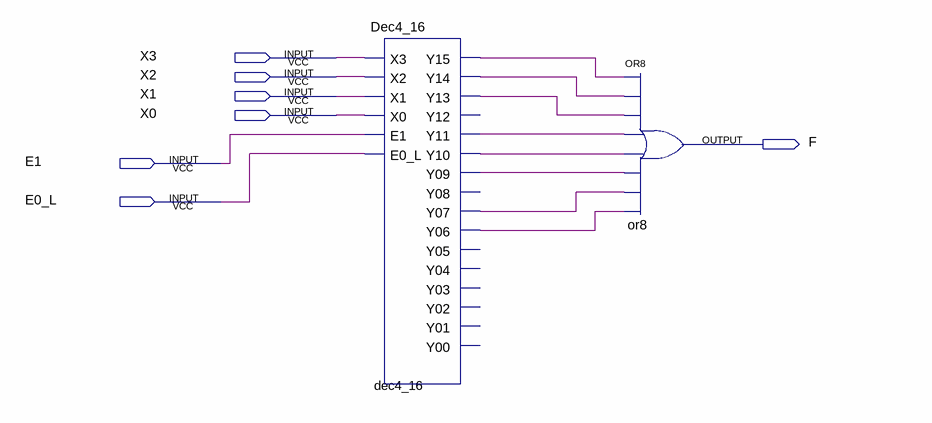
[diagram p0: schematic sheet]
// Quartus schematic DecoderDemo3.bdf as structural Verilog: 2 symbols, 7 pins
module DecoderDemo3 (
  input  X3,
  input  X2,
  input  X1,
  input  X0,
  input  E1,
  input  E0_L,
  output F
);

  wire dec4_16_y06, dec4_16_y07, dec4_16_y09, dec4_16_y10, dec4_16_y11, dec4_16_y13, dec4_16_y14, dec4_16_y15;

  Dec4_16 dec4_16 (
    .X3(X3), .X2(X2), .X1(X1), .X0(X0), .E1(E1), .E0_L(E0_L), .Y15(dec4_16_y15), .Y14(dec4_16_y14),
    .Y13(dec4_16_y13), .Y11(dec4_16_y11), .Y10(dec4_16_y10), .Y09(dec4_16_y09), .Y07(dec4_16_y07),
    .Y06(dec4_16_y06));  // open: Y12, Y08, Y05, Y04, Y03, Y02, Y01, Y00
  or or8 (F, dec4_16_y15, dec4_16_y14, dec4_16_y13, dec4_16_y11, dec4_16_y10, dec4_16_y09, dec4_16_y07, dec4_16_y06);
endmodule
